# EAGLE schematic proximity_sub_module (EAGLE 7.6.0)
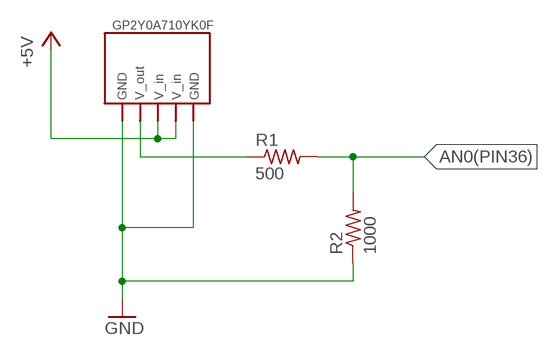
[diagram p0: schematic, sheet 1]

## Parts
R1  500  R-US_0204/2V  [0204V]
R2  1000  R-US_0204/2V  [0204V]
U$1  MOTOR  [MOTOR]

## Nets
AN0(PIN36): R1.2 R2.2
GND: R2.1
N$2: R1.1

## Library data of the parts
R1 R2 = resistor:R-US_: RESISTOR, American symbol
U$1 = sharpGP2Y0A710YK0F :MOTOR